# Altium schematic sheet 05_RFFE.SchDoc: RF front end
size A3; Organization: Lime Microsystems; Address1: Surrey Tech Centre; Address2: Guildford GU2 7YG; Address3: Surrey; Address4: United Kingdom; DocumentNumber: 2; Revision: v1.0; SheetNumber: 5; SheetTotal: 5
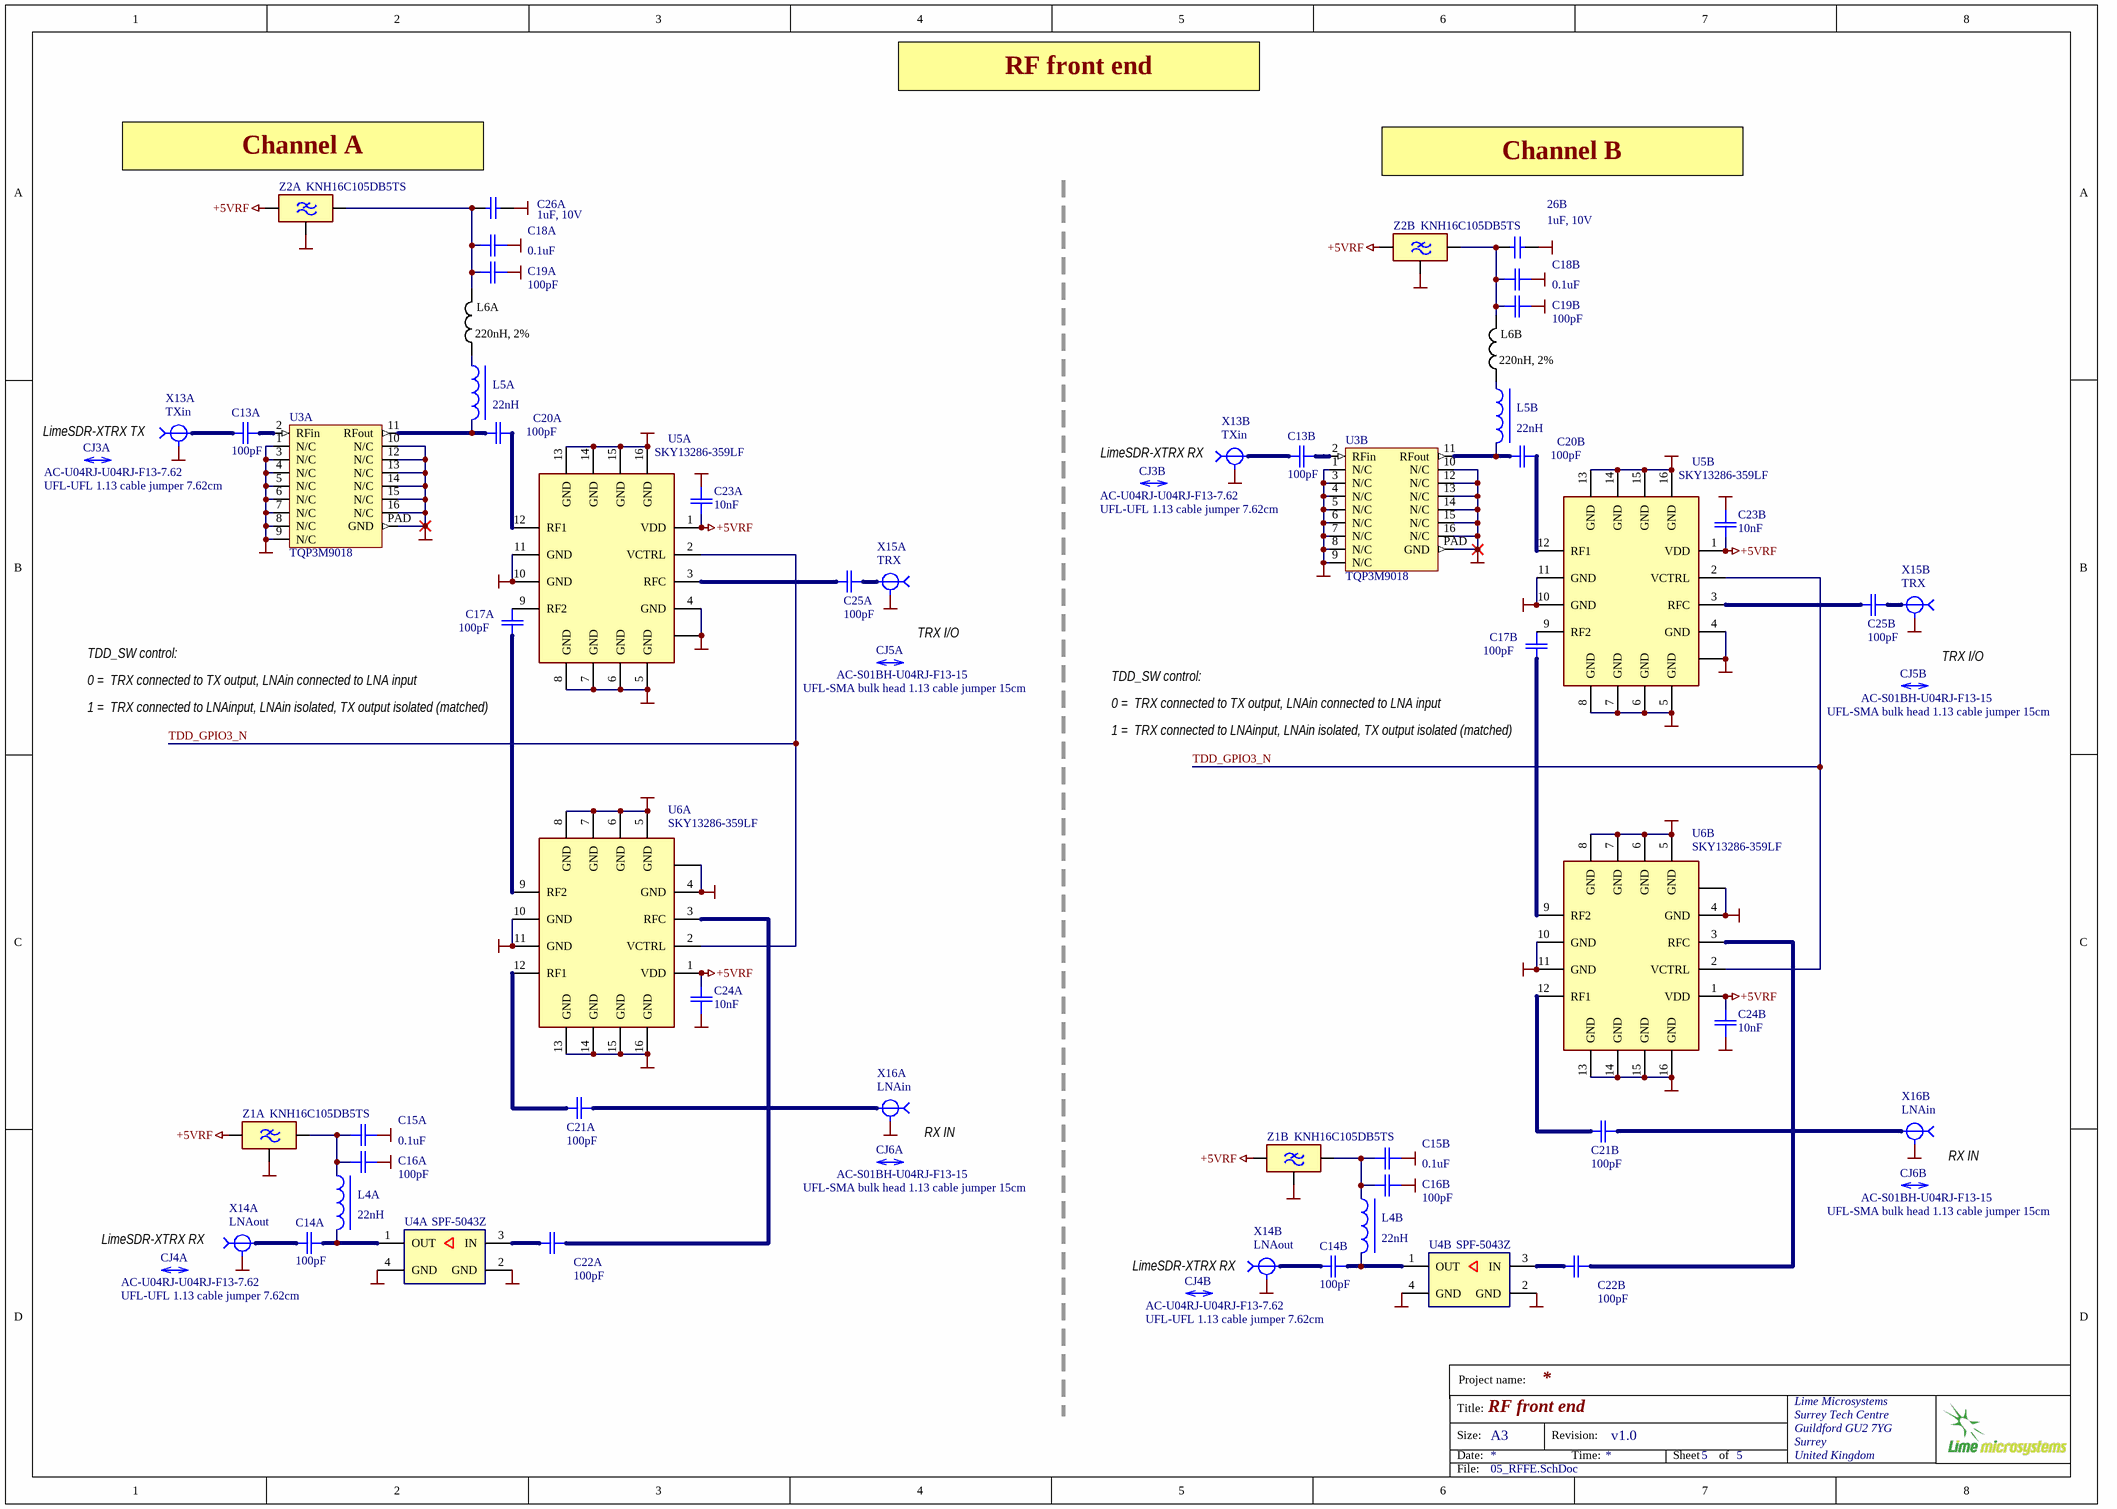
[diagram p0: 05_RFFE.SchDoc]

## Parts
26B  1uF, 10V  [CAP0402]
C13A  100pF  [C0603-PHILLIPS]
C13B  100pF  [C0603-PHILLIPS]
C14A  100pF  [C0603-PHILLIPS]
C14B  100pF  [C0603-PHILLIPS]
C15A  0.1uF  [C0603-PHILLIPS]
C15B  0.1uF  [C0603-PHILLIPS]
C16A  100pF  [C0603-PHILLIPS]
C16B  100pF  [C0603-PHILLIPS]
C17A  100pF  [C0603-PHILLIPS]
C17B  100pF  [C0603-PHILLIPS]
C18A  0.1uF  [C0603-PHILLIPS]
C18B  0.1uF  [C0603-PHILLIPS]
C19A  100pF  [C0603-PHILLIPS]
C19B  100pF  [C0603-PHILLIPS]
C20A  100pF  [C0603-PHILLIPS]
C20B  100pF  [C0603-PHILLIPS]
C21A  100pF  [C0603-PHILLIPS]
C21B  100pF  [C0603-PHILLIPS]
C22A  100pF  [C0603-PHILLIPS]
C22B  100pF  [C0603-PHILLIPS]
C23A  10nF  [C0603-PHILLIPS]
C23B  10nF  [C0603-PHILLIPS]
C24A  10nF  [C0603-PHILLIPS]
C24B  10nF  [C0603-PHILLIPS]
C25A  100pF  [C0603-PHILLIPS]
C25B  100pF  [C0603-PHILLIPS]
C26A  1uF, 10V  [CAP0402]
CJ3A  AC-U04RJ-U04RJ-F13-7.62  Misc: UFL-UFL 1.13 cable jumper 7.62cm  (mechanical)
CJ3B  AC-U04RJ-U04RJ-F13-7.62  Misc: UFL-UFL 1.13 cable jumper 7.62cm  (mechanical)
CJ4A  AC-U04RJ-U04RJ-F13-7.62  Misc: UFL-UFL 1.13 cable jumper 7.62cm  (mechanical)
CJ4B  AC-U04RJ-U04RJ-F13-7.62  Misc: UFL-UFL 1.13 cable jumper 7.62cm  (mechanical)
CJ5A  AC-S01BH-U04RJ-F13-15  Misc: UFL-SMA bulk head 1.13 cable jumper 15cm  (mechanical)
CJ5B  AC-S01BH-U04RJ-F13-15  Misc: UFL-SMA bulk head 1.13 cable jumper 15cm  (mechanical)
CJ6A  AC-S01BH-U04RJ-F13-15  Misc: UFL-SMA bulk head 1.13 cable jumper 15cm  (mechanical)
CJ6B  AC-S01BH-U04RJ-F13-15  Misc: UFL-SMA bulk head 1.13 cable jumper 15cm  (mechanical)
L4A  22nH  [TF160808-Phillips]
L4B  22nH  [TF160808-Phillips]
L5A  22nH  [TF160808-Phillips]
L5B  22nH  [TF160808-Phillips]
L6A  220nH, 2%  [RES0603]
L6B  220nH, 2%  [RES0603]
U3A  TQP3M9018  [TQP3M9018_PA_QFN16]
U3B  TQP3M9018  [TQP3M9018_PA_QFN16]
U4A  SPF-5043Z  [SOT-343[2X1.25]]
U4B  SPF-5043Z  [SOT-343[2X1.25]]
U5A  SKY13286-359LF  [QFN16(4x4/0.65mm) SQ]
U5B  SKY13286-359LF  [QFN16(4x4/0.65mm) SQ]
U6A  SKY13286-359LF  [QFN16(4x4/0.65mm) SQ]
U6B  SKY13286-359LF  [QFN16(4x4/0.65mm) SQ]
X13A  Misc: TXin  [U_FL]  (hidden comment: 0734120110)
X13B  Misc: TXin  [U_FL]  (hidden comment: 0734120110)
X14A  Misc: LNAout  [U_FL]  (hidden comment: 0734120110)
X14B  Misc: LNAout  [U_FL]  (hidden comment: 0734120110)
X15A  Misc: TRX  [U_FL]  (hidden comment: 0734120110)
X15B  Misc: TRX  [U_FL]  (hidden comment: 0734120110)
X16A  Misc: LNAin  [U_FL]  (hidden comment: 0734120110)
X16B  Misc: LNAin  [U_FL]  (hidden comment: 0734120110)
Z1A  KNH16C105DB5TS  [KNH16 - DB Serie]
Z1B  KNH16C105DB5TS  [KNH16 - DB Serie]
Z2A  KNH16C105DB5TS  [KNH16 - DB Serie]
Z2B  KNH16C105DB5TS  [KNH16 - DB Serie]

## Nets
+5VRF: C23A.1 C23B.1 C24A.1 C24B.1 U5A.1(VDD) U5B.1(VDD) U6A.1(VDD) U6B.1(VDD) Z1A.1 Z1B.1 Z2A.1 Z2B.1
GND: 26B.1 C15A.2 C15B.2 C16A.2 C16B.2 C18A.2 C18B.2 C19A.2 C19B.2 C23A.2 C23B.2 C24A.2 C24B.2 C26A.1 U3A.1(N/C) U3A.3(N/C) U3A.4(N/C) U3A.5(N/C) U3A.6(N/C) U3A.7(N/C) U3A.8(N/C) U3A.9(N/C) U3A.10(N/C) U3A.12(N/C) U3A.13(N/C) U3A.14(N/C) U3A.15(N/C) U3A.16(N/C) U3A.PAD(GND) U3B.1(N/C) U3B.3(N/C) U3B.4(N/C) U3B.5(N/C) U3B.6(N/C) U3B.7(N/C) U3B.8(N/C) U3B.9(N/C) U3B.10(N/C) U3B.12(N/C) U3B.13(N/C) U3B.14(N/C) U3B.15(N/C) U3B.16(N/C) U3B.PAD(GND) U4A.2(GND) U4A.4(GND) U4B.2(GND) U4B.4(GND) U5A.0(PAD) U5A.4(GND) U5A.5(GND) U5A.6(GND) U5A.7(GND) U5A.8(GND) U5A.10(GND) U5A.11(GND) U5A.13(GND) U5A.14(GND) U5A.15(GND) U5A.16(GND) U5B.0(PAD) U5B.4(GND) U5B.5(GND) U5B.6(GND) U5B.7(GND) U5B.8(GND) U5B.10(GND) U5B.11(GND) U5B.13(GND) U5B.14(GND) U5B.15(GND) U5B.16(GND) U6A.0(PAD) U6A.4(GND) U6A.5(GND) U6A.6(GND) U6A.7(GND) U6A.8(GND) U6A.10(GND) U6A.11(GND) U6A.13(GND) U6A.14(GND) U6A.15(GND) U6A.16(GND) U6B.0(PAD) U6B.4(GND) U6B.5(GND) U6B.6(GND) U6B.7(GND) U6B.8(GND) U6B.10(GND) U6B.11(GND) U6B.13(GND) U6B.14(GND) U6B.15(GND) U6B.16(GND) X13A.2(GND) X13B.2(GND) X14A.2(GND) X14B.2(GND) X15A.2(GND) X15B.2(GND) X16A.2(GND) X16B.2(GND) Z1A.2 Z1B.2 Z2A.2 Z2B.2
TDD_GPIO3_N: U5A.2(VCTRL) U5B.2(VCTRL) U6A.2(VCTRL) U6B.2(VCTRL)
Net26B_2: 26B.2 C18B.1 C19B.1 L6B.1 Z2B.3
NetC13A_1: C13A.1 X13A.1
NetC13A_2: C13A.2 U3A.2(RFin)
NetC13B_1: C13B.1 X13B.1
NetC13B_2: C13B.2 U3B.2(RFin)
NetC14A_1: C14A.1 X14A.1
NetC14A_2: C14A.2 L4A.2 U4A.1(OUT)
NetC14B_1: C14B.1 X14B.1
NetC14B_2: C14B.2 L4B.2 U4B.1(OUT)
NetC15A_1: C15A.1 C16A.1 L4A.1 Z1A.3
NetC15B_1: C15B.1 C16B.1 L4B.1 Z1B.3
NetC17A_1: C17A.1 U6A.9(RF2)
NetC17A_2: C17A.2 U5A.9(RF2)
NetC17B_1: C17B.1 U6B.9(RF2)
NetC17B_2: C17B.2 U5B.9(RF2)
NetC18A_1: C18A.1 C19A.1 C26A.2 L6A.1 Z2A.3
NetC20A_1: C20A.1 L5A.2 U3A.11(RFout)
NetC20A_2: C20A.2 U5A.12(RF1)
NetC20B_1: C20B.1 L5B.2 U3B.11(RFout)
NetC20B_2: C20B.2 U5B.12(RF1)
NetC21A_1: C21A.1 U6A.12(RF1)
NetC21A_2: C21A.2 X16A.1
NetC21B_1: C21B.1 U6B.12(RF1)
NetC21B_2: C21B.2 X16B.1
NetC22A_1: C22A.1 U4A.3(IN)
NetC22A_2: C22A.2 U6A.3(RFC)
NetC22B_1: C22B.1 U4B.3(IN)
NetC22B_2: C22B.2 U6B.3(RFC)
NetC25A_1: C25A.1 U5A.3(RFC)
NetC25A_2: C25A.2 X15A.1
NetC25B_1: C25B.1 U5B.3(RFC)
NetC25B_2: C25B.2 X15B.1
NetL5A_1: L5A.1 L6A.2
NetL5B_1: L5B.1 L6B.2

Not connected (* = marked no-connect by the designer): CJ3A ?1; CJ3B ?1; CJ4A ?1; CJ4B ?1; CJ5A ?1; CJ5B ?1; CJ6A ?1; CJ6B ?1

## Notes on the sheet
- RF front end
- Channel A
- Channel B
- LimeSDR-XTRX TX
- LimeSDR-XTRX RX
- TRX I/O
- TDD_SW control:
- (near U5A) 0 =  TRX connected to TX output, LNAin connected to LNA input
- (near U5A) 1 =  TRX connected to LNAinput, LNAin isolated, TX output isolated (matched)
- (near U5B) 0 =  TRX connected to TX output, LNAin connected to LNA input
- (near U5B) 1 =  TRX connected to LNAinput, LNAin isolated, TX output isolated (matched)
- RX IN
- Project name:
- Title:
- Size:
- Date:
- A3
- Revision:
- Time:
- Sheet
- of
- File:

## Library data of the parts
26B C26A = Cap_0402: CAP CER 1UF 10V X5R 0402; Manufacturer: Yageo; Part Description: 1µF 10V Ceramic Capacitor X5R 0402 (1005 Metric) 0.039" L x 0.020" W (1.00mm x 0.50mm); Manufacturer Part Number 1: CC0402MRX5R6BB105; Notification: Current market demand for these product types have resulted in fluctuating and extending lead times. Lead times may differ.; Tolerance: ±20%; Value: 1uF, 10V; Supplier 1: Digi-Key; Supplier Part Number 1: 311-1732-1-ND; RoHS: RoHS Compliant; Applications: General Purpose; Category: Capacitors; ComponentLink1Description: http://www.yageo.com/documents/recent/UPY-GPHC_X5R_4V-to-50V_25.pdf; ComponentLink1URL: http://www.yageo.com/documents/recent/UPY-GPHC_X5R_4V-to-50V_25.pdf; Failure Rate: -; Features: -; Height - Seated (Max): -; Lead Spacing: -; Lead Style: -; Mounting Type: Surface Mount, MLCC; Operating Temperature: -55°C ~ 85°C; Package / Case: 0402 (1005 Metric); Packaging: Cut Tape (CT); Part Status: Active; Pricing 1: 1=0.22, 10=0.156, 100=0.0732, 500=0.0513, 1000=0.04248, 2500=0.03953, 5000=0.03617 (USD); Ratings: -; Size / Dimension: 0.039" L x 0.020" W (1.00mm x 0.50mm); Stock 1: 69600; Temperature Coefficient: X5R; Thickness (Max): 0.022" (0.55mm); Voltage - Rated: 10V
C13A C13B C14A C14B C16A C16B C17A C17B C19A C19B C20A C20B C21A C21B C22A C22B C25A C25B = C0603: Capacitor; Manufacturer: MURATA; Tolerance: 20%; Name: SMD0603; U/P/TKE: NP0; Value: 100pF
C15A C15B C18A C18B C23A C23B C24A C24B = C0603: Capacitor; Manufacturer: MURATA; Tolerance: 20%; Name: SMD0603; U/P/TKE: X7R
  C15A C15B C18A C18B: Value: 0.1uF
  C23A C23B C24A C24B: Value: 10nF
CJ3A CJ3B CJ4A CJ4B CJ5A CJ5B CJ6A CJ6B = Mating part: Cable jumper; Manufacturer: RFSupplier
  CJ3A CJ3B CJ4A CJ4B: Name: AC-U04RJ-U04RJ-F13-7.62; Link: https://rfsupplier.com/customcable.html
  CJ5A CJ5B CJ6A CJ6B: Name: AC-S01BH-U04RJ-F13-15; Link: https://rfsupplier.com/sma-female-to-ipex-ufl-connector-cable-with-rg113-cbale_p6418.html
L4A L4B L5A L5B = TF160808: Coil; Manufacturer: MuRata; Misc: Self Resonance >4GHz; Name: LQW18AN22NG00D; Value: 22nH; Link: https://octopart.com/lqw18an22ng00d-murata-890271
L6A L6B = Inductor: Power Inductors - SMD .22 UH 20%; Part Description: Fixed Inductors 22 NH 2%; Manufacturer: TDK; Manufacturer Part Number 1: MLZ1608DR22DT000; Value: 220nH, 2%; ComponentLink1URL: http://productfinder.pulseeng.com/products/datasheets/WC701.pdf; ComponentLink1Description: http://productfinder.pulseeng.com/products/datasheets/WC701.pdf; ComponentLink2URL: https://datasheet.ciiva.com/11799/0900766b80a002db-11799279.pdf?src-supplier=RSComponents; ComponentLink2Description: https://datasheet.ciiva.com/11799/0900766b80a002db-11799279.pdf?src-supplier=RSComponents; ComponentLink3URL: https://datasheet.ciiva.com/14124/qhlqw18a-data-e-14124619.pdf?src-supplier=Distrelec; ComponentLink3Description: https://datasheet.ciiva.com/14124/qhlqw18a-data-e-14124619.pdf?src-supplier=Distrelec; ComponentLink4URL: https://datasheet.ciiva.com/6705/l0075s0080lqw18a-00-6705627.pdf?src-supplier=Digi-Key; ComponentLink4Description: https://datasheet.ciiva.com/6705/l0075s0080lqw18a-00-6705627.pdf?src-supplier=Digi-Key; ComponentLink5URL: https://datasheet.ciiva.com/6705/l0075s0080lqw18a-00-6705626.pdf?src-supplier=Digi-Key; ComponentLink5Description: https://datasheet.ciiva.com/6705/l0075s0080lqw18a-00-6705626.pdf?src-supplier=Digi-Key; ComponentLink6URL: https://datasheet.ciiva.com/6705/l0075s0080lqw18a-00-6705631.pdf?src-supplier=Digi-Key; ComponentLink6Description: https://datasheet.ciiva.com/6705/l0075s0080lqw18a-00-6705631.pdf?src-supplier=Digi-Key; ComponentLink7URL: https://datasheet.ciiva.com/4977/product-4977173.pdf?src-supplier=Mouser; ComponentLink7Description: https://datasheet.ciiva.com/4977/product-4977173.pdf?src-supplier=Mouser; ComponentLink8URL: https://datasheet.ciiva.com/46391/1487239-46391853.pdf?src-supplier=Element14; ComponentLink8Description: https://datasheet.ciiva.com/46391/1487239-46391853.pdf?src-supplier=Element14; ComponentLink9URL: https://datasheet.ciiva.com/8507/l0075s0080lqw18a-00-8507496.pdf?src-supplier=Avnet; ComponentLink9Description: https://datasheet.ciiva.com/8507/l0075s0080lqw18a-00-8507496.pdf?src-supplier=Avnet; Supplier 1: Digikey; Supplier Part Number 1: 445-6387-1-ND; Stock 1: 11427; Pricing 1: 1=0,12, 10=0,095, 25=0,0876, 50=0,0772, 100=0,0676, 250=0,06436, 500=0,06052, 1000=0,04635 (USD); RoHS: Yes; ComponentLink10URL: https://datasheet.ciiva.com/29698/inductor-commercial-decoupling-mlz-en-29698909.pdf?src-supplier=Digikey; ComponentLink10Description: https://datasheet.ciiva.com/29698/inductor-commercial-decoupling-mlz-en-29698909.pdf?src-supplier=Digikey; ComponentLink11URL: https://datasheet.ciiva.com/29698/inductor-commercial-decoupling-mlz-en-29698910.pdf?src-supplier=Digikey; ComponentLink11Description: https://datasheet.ciiva.com/29698/inductor-commercial-decoupling-mlz-en-29698910.pdf?src-supplier=Digikey; ComponentLink12URL: https://datasheet.ciiva.com/29698/inductor-commercial-decoupling-mlz-en-29698911.pdf?src-supplier=Digikey; ComponentLink12Description: https://datasheet.ciiva.com/29698/inductor-commercial-decoupling-mlz-en-29698911.pdf?src-supplier=Digikey
U3A U3B = TQP3M9018_PA: RF Amplifier .05-4GHz P1dB= 22dB Gain 26.4dB 5Volts; Manufacturer: Qorvo; Manufacturer Part Number 1: TQP3M9019; Part Description: RF Amplifier .05-4GHz P1dB= 22dB Gain 26.4dB 5Volts; Supplier 1: Mouser; Supplier Part Number 1: 772-TQP3M9019; Stock 1: 6804; Pricing 1: 1=7,48, 10=7,48, 50=5,43, 100=4,41, 1000=2,44, 10000=2,35 (USD); RoHS: Yes
  U3A: Decription: RF Amplifier .05-4GHz P1dB= 22dB Gain 26.4dB 5Volts
U4A U4B = SPF-5043Z: IC; Manufacturer: RFMD; Swap: No; Name: SPF-5043Z; Link: https://octopart.com/search?q=SPF+5043Z
U5A U5B U6A U6B = SKY13286-359LF: IC RF SPDT Absorptive Switch; Manufacturer: Skyworks; Misc: SPDT 0.1-6 GHz Hi Isol Absorptive Switch; Swap: No; U/P/TKE: 3-5V; Name: SKY13286-359LF; Link: https://octopart.com/sky13286-359lf-skyworks+solutions-3998422
X13A X13B X14A X14B X15A X15B X16A X16B = U_FL: Connector (UMCC); Manufacturer: Molex; Name: 0734120110; Link: https://octopart.com/0734120110-molex-16756629
Z1A Z1B Z2A Z2B = KNH16 Serie: EMI Filter; Manufacturer: AVX / Kyocera; Misc: Power line EMI Filter 0603 Size; Value: 1uF/10V/2A; Name: KNH16C105DB5TS; Link: https://octopart.com/knh16c105db5ts-avx-21214733